# EAGLE design pcbmotor (EAGLE 9.3.2)
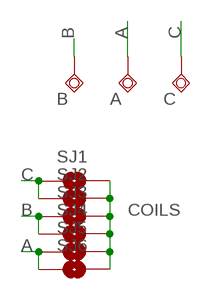
[diagram p0: schematic, sheet 1]

## Parts
A  TESTPAD_TPSQPAD1-20Y  [TESTPAD_P1-20Y]
B  TESTPAD_TPSQPAD1-20Y  [TESTPAD_P1-20Y]
C  TESTPAD_TPSQPAD1-20Y  [TESTPAD_P1-20Y]
SJ1  SOLDERJUMPERTRACE  [SJ_2S-TRACE]
SJ2  SOLDERJUMPERTRACE  [SJ_2S-TRACE]
SJ3  SOLDERJUMPERTRACE  [SJ_2S-TRACE]
SJ4  SOLDERJUMPERTRACE  [SJ_2S-TRACE]
SJ5  SOLDERJUMPERTRACE  [SJ_2S-TRACE]
SJ6  SOLDERJUMPERTRACE  [SJ_2S-TRACE]

## Nets
A: A.TP SJ5.1 SJ6.1
B: B.TP SJ3.1 SJ4.1
C: C.TP SJ1.1 SJ2.1
COILS: SJ1.2 SJ2.2 SJ3.2 SJ4.2 SJ5.2 SJ6.2

## Library data of the parts
A B C = BeagleBone_Blue_R3:TESTPAD_TPSQ: Test pad
SJ1-SJ6 = SparkFun:SOLDERJUMPER: Solder Jumper Standard SMD solder jumper. Used to automate production. Two varients : Normally Open and Normally Closed are the same, but have different paste layers. NC will have a large amount of paste and should jumper during reflow.

## Board
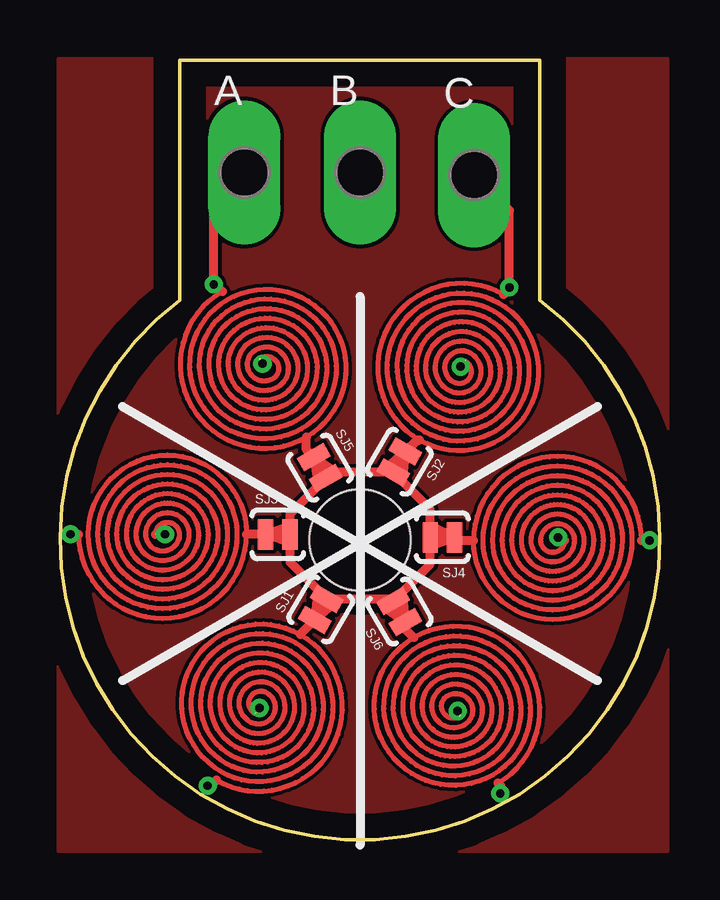
[diagram p1: board, top side]
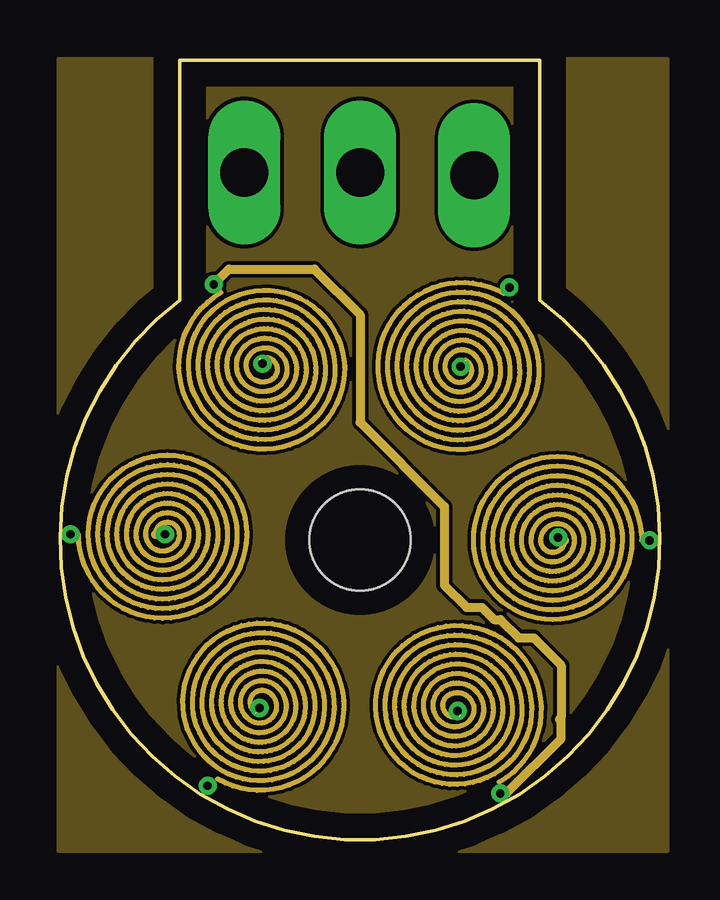
[diagram p2: board, inner layer Route2]
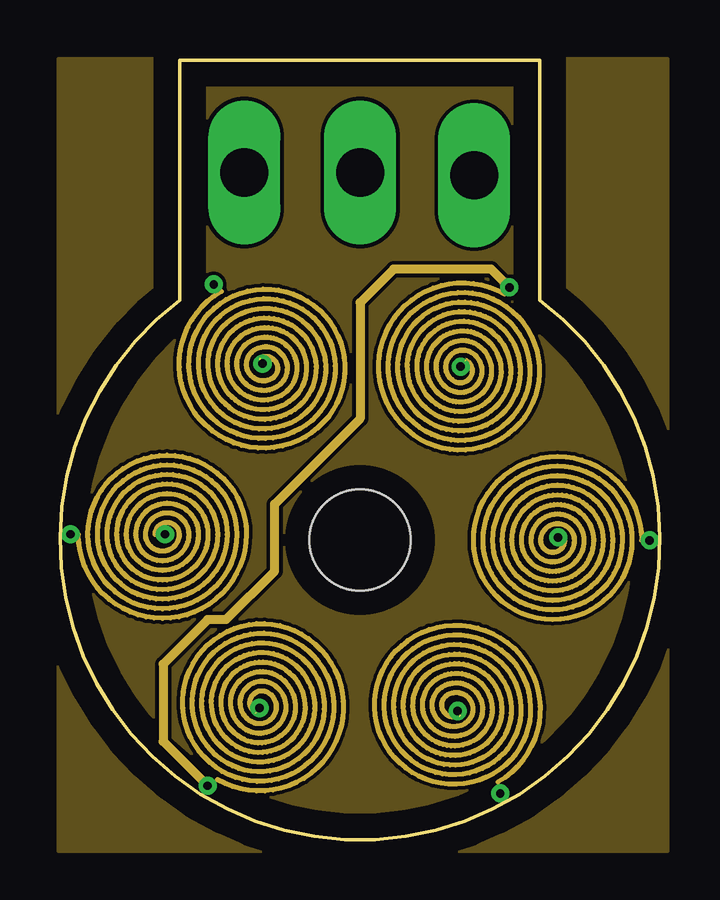
[diagram p3: board, inner layer Route15]
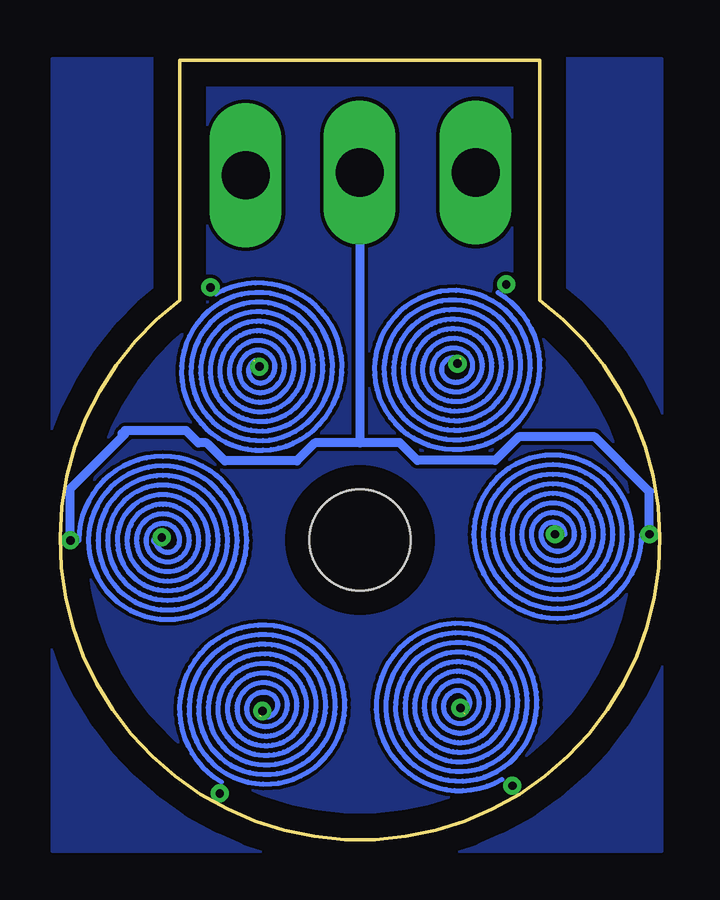
[diagram p4: board, bottom side, seen from below]

Size 25 x 32.48 mm. Coordinates in mm from the lower left corner, seen from the top.
Outline: 20,32.48 5,32.48 5,22.48 arc286 20,22.48 20,32.48
Copper layers (1+2*15+16): Top 0.035mm / dielectric 1.5mm / Route2 0.035mm / dielectric 0.15mm / Route15 0.035mm / dielectric 0.2mm / Bottom 0.035mm
Design rules "default *": minimum track width 6mil, minimum drill 0.35mm, track to track 6mil, track to pad 6mil, pad to pad 6mil, via to via 6mil, smd to smd 6mil, copper to edge 40mil, drill to drill 6mil, minimum pad ring 10mil, minimum via ring 8mil, stop-mask expansion 4mil, vias tented up to drill 0mil, thermal gap 10mil
Holes 4.2 mm at 12.5,12.48

### Footprints (pad centres in the part's own frame; a part is rotated, then mirrored left to right if it is on the bottom)
TESTPAD_P1-20Y = drill 2.007 pad 2.54 long: TP 0,0
SJ_2S-TRACE = smd 0.635 x 1.27: 1 -0.508,0; 2 0.508,0

### Placement (x,y rotation side)
A  7.68,27.79 0 top
B  12.51,27.79 0 top
C  17.26,27.68 0 top
SJ1  10.86,9.59 60 top
SJ2  14.14,15.74 240 top
SJ3  9.07,12.72 0 top
SJ4  15.93,12.59 180 top
SJ5  10.82,15.5 300 top
SJ6  14.14,9.5 120 top

### Tracks (layer width: path | path; a pad name or v marks a point on that pad's centre or on a via)
A  (via drill 0.35)  (6 unrouted)
  Top 0.2: 8.36,20.06 arc-180 8.86,19.2 arc-180 8.16,20.41 arc-180 9.06,18.85 arc-180 7.96,20.76 arc-180 9.26,18.5 arc-180 7.76,21.1 arc-180 9.46,18.16 arc-180 7.56,21.45 arc-180 9.66,17.81 arc-180 7.36,21.8 arc-180 9.86,17.47 arc-180 7.16,22.14 arc-180 10.06,17.12 arc-180 6.96,22.49 arc-180 10.26,16.77 arc-180 6.76,22.83 | 16.64,5.13 arc-180 16.14,5.99 arc-180 16.84,4.78 arc-180 15.94,6.34 arc-180 17.04,4.43 arc-180 15.74,6.68 arc-180 17.24,4.09 arc-180 15.54,7.03 arc-180 17.44,3.74 arc-180 15.34,7.38 arc-180 17.64,3.39 arc-180 15.14,7.72 arc-180 17.84,3.05 arc-180 14.94,8.07 arc-180 18.04,2.7 arc-180 14.74,8.42 arc-180 18.24,2.35
  Top 0.381: v18.34,1.93 18.34,2.25 18.24,2.35 | 6.76,22.83 6.46,23.14 v6.41,23.14 6.41,26.52 A.TP | SJ6.1 14.4,8.77 14.74,8.42 | SJ5.1 10.26,16.25 10.26,16.77 | SJ6.1 13.52,9.67 14.28,10.05 SJ6.1 | SJ5.1 11.36,15.39 10.72,15.01 SJ5.1
  Route2 0.2: 8.31,20.02 arc-180 8.81,19.16 arc-180 8.11,20.37 arc-180 9.01,18.81 arc-180 7.91,20.72 arc-180 9.21,18.47 arc-180 7.71,21.06 arc-180 9.41,18.12 arc-180 7.51,21.41 arc-180 9.61,17.77 arc-180 7.31,21.76 arc-180 9.81,17.43 arc-180 7.11,22.1 arc-180 10.01,17.08 arc-180 6.91,22.45 arc-180 10.21,16.73 arc-180 6.71,22.8 | 16.7,5.16 arc-180 16.2,6.03 arc-180 16.9,4.82 arc-180 16,6.38 arc-180 17.1,4.47 arc-180 15.8,6.72 arc-180 17.3,4.13 arc-180 15.6,7.07 arc-180 17.5,3.78 arc-180 15.4,7.42 arc-180 17.7,3.43 arc-180 15.2,7.76 arc-180 17.9,3.09 arc-180 15,8.11 arc-180 18.1,2.74 arc-180 14.8,8.46 arc-180 18.3,2.39
  Route2 0.381: v6.41,23.14 7.04,23.77 10.6,23.77 12.5,21.87 12.5,17.39 16.02,13.87 16.02,10.6 16.95,9.67 17.58,9.67 18.09,9.17 18.34,9.17 19.11,8.4 19.74,8.4 20.88,7.26 20.88,5.09 | 20.88,5.09 20.81,5 | v18.34,1.93 18.6,1.93 20.88,4.21 20.88,5.09
  Route15 0.2: 16.66,5.17 arc-180 16.16,6.04 arc-180 16.86,4.83 arc-180 15.96,6.38 arc-180 17.06,4.48 arc-180 15.76,6.73 arc-180 17.26,4.13 arc-180 15.56,7.08 arc-180 17.46,3.79 arc-180 15.36,7.42 arc-180 17.66,3.44 arc-180 15.16,7.77 arc-180 17.86,3.09 arc-180 14.96,8.12 arc-180 18.06,2.75 arc-180 14.76,8.46 arc-180 18.26,2.4 | 8.32,20.07 arc-180 8.82,19.2 arc-180 8.12,20.42 arc-180 9.02,18.86 arc-180 7.92,20.76 arc-180 9.22,18.51 arc-180 7.72,21.11 arc-180 9.42,18.17 arc-180 7.52,21.46 arc-180 9.62,17.82 arc-180 7.32,21.8 arc-180 9.82,17.47 arc-180 7.12,22.15 arc-180 10.02,17.13 arc-180 6.92,22.5 arc-180 10.22,16.78 arc-180 6.72,22.84
  Bottom 0.2: 8.35,20.01 arc-180 8.85,19.15 arc-180 8.15,20.36 arc-180 9.05,18.8 arc-180 7.95,20.71 arc-180 9.25,18.46 arc-180 7.75,21.05 arc-180 9.45,18.11 arc-180 7.55,21.4 arc-180 9.65,17.76 arc-180 7.35,21.75 arc-180 9.85,17.42 arc-180 7.15,22.09 arc-180 10.05,17.07 arc-180 6.95,22.44 arc-180 10.25,16.72 arc-180 6.75,22.79 | 16.67,5.18 arc-180 16.17,6.04 arc-180 16.87,4.83 arc-180 15.97,6.39 arc-180 17.07,4.49 arc-180 15.77,6.74 arc-180 17.27,4.14 arc-180 15.57,7.08 arc-180 17.47,3.79 arc-180 15.37,7.43 arc-180 17.67,3.45 arc-180 15.17,7.78 arc-180 17.87,3.1 arc-180 14.97,8.12 arc-180 18.07,2.75 arc-180 14.77,8.47 arc-180 18.27,2.41
B  (via drill 0.35)  (3 unrouted)
  Top 0.2: 21.03,12.47 arc-180 20.03,12.47 arc-180 21.43,12.47 arc-180 19.63,12.47 arc-180 21.83,12.47 arc-180 19.23,12.47 arc-180 22.23,12.47 arc-180 18.83,12.47 arc-180 22.63,12.47 arc-180 18.43,12.47 arc-180 23.03,12.47 arc-180 18.03,12.47 arc-180 23.43,12.47 arc-180 17.63,12.47 arc-180 23.83,12.47 arc-180 17.23,12.47 arc-180 24.23,12.47 | 3.97,12.72 arc-180 4.97,12.72 arc-180 3.57,12.72 arc-180 5.37,12.72 arc-180 3.17,12.72 arc-180 5.77,12.72 arc-180 2.77,12.72 arc-180 6.17,12.72 arc-180 2.37,12.72 arc-180 6.57,12.72 arc-180 1.97,12.72 arc-180 6.97,12.72 arc-180 1.57,12.72 arc-180 7.37,12.72 arc-180 1.17,12.72 arc-180 7.77,12.72 arc-180 0.77,12.72
  Top 0.381: 0.77,12.72 v0.44,12.72 0.56,12.85 | v24.57,12.47 24.23,12.47 | B.TP 12.35,27.64 | SJ4.1 16.57,12.47 17.23,12.47 | SJ3.1 7.77,12.72 | SJ4.1 15.42,12.21 15.42,13.1 SJ4.1 | SJ3.1 9.58,13.1 9.58,12.34 SJ3.1 | v4.37,12.72 3.97,12.72 | v20.76,12.59 21.03,12.47
  Route2 0.2: 3.97,12.72 arc-180 4.97,12.72 arc-180 3.57,12.72 arc-180 5.37,12.72 arc-180 3.17,12.72 arc-180 5.77,12.72 arc-180 2.77,12.72 arc-180 6.17,12.72 arc-180 2.37,12.72 arc-180 6.57,12.72 arc-180 1.97,12.72 arc-180 6.97,12.72 arc-180 1.57,12.72 arc-180 7.37,12.72 arc-180 1.17,12.72 arc-180 7.77,12.72 arc-180 0.77,12.72 | 21.03,12.47 arc-180 20.03,12.47 arc-180 21.43,12.47 arc-180 19.63,12.47 arc-180 21.83,12.47 arc-180 19.23,12.47 arc-180 22.23,12.47 arc-180 18.83,12.47 arc-180 22.63,12.47 arc-180 18.43,12.47 arc-180 23.03,12.47 arc-180 18.03,12.47 arc-180 23.43,12.47 arc-180 17.63,12.47 arc-180 23.83,12.47 arc-180 17.23,12.47 arc-180 24.23,12.47
  Route2 0.381: v20.76,12.59 21.03,12.47 | 3.97,12.72 v4.37,12.72
  Route15 0.2: 3.97,12.72 arc-180 4.97,12.72 arc-180 3.57,12.72 arc-180 5.37,12.72 arc-180 3.17,12.72 arc-180 5.77,12.72 arc-180 2.77,12.72 arc-180 6.17,12.72 arc-180 2.37,12.72 arc-180 6.57,12.72 arc-180 1.97,12.72 arc-180 6.97,12.72 arc-180 1.57,12.72 arc-180 7.37,12.72 arc-180 1.17,12.72 arc-180 7.77,12.72 arc-180 0.77,12.72 | 21.03,12.47 arc-180 20.03,12.47 arc-180 21.43,12.47 arc-180 19.63,12.47 arc-180 21.83,12.47 arc-180 19.23,12.47 arc-180 22.23,12.47 arc-180 18.83,12.47 arc-180 22.63,12.47 arc-180 18.43,12.47 arc-180 23.03,12.47 arc-180 18.03,12.47 arc-180 23.43,12.47 arc-180 17.63,12.47 arc-180 23.83,12.47 arc-180 17.23,12.47 arc-180 24.23,12.47
  Bottom 0.2: 3.96,12.72 arc-180 4.96,12.72 arc-180 3.56,12.72 arc-180 5.36,12.72 arc-180 3.16,12.72 arc-180 5.76,12.72 arc-180 2.76,12.72 arc-180 6.16,12.72 arc-180 2.36,12.72 arc-180 6.56,12.72 arc-180 1.96,12.72 arc-180 6.96,12.72 arc-180 1.56,12.72 arc-180 7.36,12.72 arc-180 1.16,12.72 arc-180 7.76,12.72 arc-180 0.76,12.72 | 21.01,12.47 arc-180 20.01,12.47 arc-180 21.41,12.47 arc-180 19.61,12.47 arc-180 21.81,12.47 arc-180 19.21,12.47 arc-180 22.21,12.47 arc-180 18.81,12.47 arc-180 22.61,12.47 arc-180 18.41,12.47 arc-180 23.01,12.47 arc-180 18.01,12.47 arc-180 23.41,12.47 arc-180 17.61,12.47 arc-180 23.81,12.47 arc-180 17.21,12.47 arc-180 24.21,12.47
  Bottom 0.381: B.TP 12.51,16.54 | 12.51,16.54 12.5,16.53 14.38,16.53 15.13,15.78 18.13,15.78 18.8,16.45 18.9,16.53 19.23,16.53 19.74,17.04 22.28,17.04 | 22.28,17.04 22.41,16.91 | v24.57,12.47 24.57,14.63 22.28,16.91 22.28,17.04 | v0.44,12.72 0.44,14.5 2.72,16.79 5.89,16.79 6.87,15.8 10.11,15.8 10.84,16.54 12.51,16.54 | v20.76,12.59 21.01,12.47
C  (via drill 0.35)  (6 unrouted)
  Top 0.2: 16.89,19.94 arc-180 16.39,19.07 arc-180 17.09,20.28 arc-180 16.19,18.72 arc-180 17.29,20.63 arc-180 15.99,18.38 arc-180 17.49,20.98 arc-180 15.79,18.03 arc-180 17.69,21.32 arc-180 15.59,17.68 arc-180 17.89,21.67 arc-180 15.39,17.34 arc-180 18.09,22.01 arc-180 15.19,16.99 arc-180 18.29,22.36 arc-180 14.99,16.65 arc-180 18.49,22.71 | 8.12,5.25 arc-180 8.62,6.12 arc-180 7.92,4.91 arc-180 8.82,6.47 arc-180 7.72,4.56 arc-180 9.02,6.81 arc-180 7.52,4.21 arc-180 9.22,7.16 arc-180 7.32,3.87 arc-180 9.42,7.5 arc-180 7.12,3.52 arc-180 9.62,7.85 arc-180 6.92,3.17 arc-180 9.82,8.2 arc-180 6.72,2.83 arc-180 10.02,8.54 arc-180 6.52,2.48
  Top 0.381: v6.15,2.24 6.28,2.24 6.52,2.48 | 18.49,22.71 18.73,22.94 v18.73,23.01 18.73,26.22 C.TP | SJ1.1 10.02,8.56 10.02,8.54 | SJ2.1 14.86,16.65 14.99,16.65 | SJ1.1 11.36,9.8 10.72,10.18 SJ1.1 | SJ2.1 14.28,15.13 13.65,15.52 SJ2.1
  Route2 0.2: 16.9,19.98 arc-180 16.4,19.11 arc-180 17.1,20.32 arc-180 16.2,18.77 arc-180 17.3,20.67 arc-180 16,18.42 arc-180 17.5,21.02 arc-180 15.8,18.07 arc-180 17.7,21.36 arc-180 15.6,17.73 arc-180 17.9,21.71 arc-180 15.4,17.38 arc-180 18.1,22.06 arc-180 15.2,17.03 arc-180 18.3,22.4 arc-180 15,16.69 arc-180 18.5,22.75 | 8.17,5.29 arc-180 8.67,6.16 arc-180 7.97,4.95 arc-180 8.87,6.5 arc-180 7.77,4.6 arc-180 9.07,6.85 arc-180 7.57,4.25 arc-180 9.27,7.2 arc-180 7.37,3.91 arc-180 9.47,7.54 arc-180 7.17,3.56 arc-180 9.67,7.89 arc-180 6.97,3.21 arc-180 9.87,8.24 arc-180 6.77,2.87 arc-180 10.07,8.58 arc-180 6.57,2.52
  Route15 0.2: 8.16,5.27 arc-180 8.66,6.13 arc-180 7.96,4.92 arc-180 8.86,6.48 arc-180 7.76,4.58 arc-180 9.06,6.83 arc-180 7.56,4.23 arc-180 9.26,7.17 arc-180 7.36,3.88 arc-180 9.46,7.52 arc-180 7.16,3.54 arc-180 9.66,7.87 arc-180 6.96,3.19 arc-180 9.86,8.21 arc-180 6.76,2.84 arc-180 10.06,8.56 arc-180 6.56,2.5 | 16.93,19.96 arc-180 16.43,19.09 arc-180 17.13,20.31 arc-180 16.23,18.75 arc-180 17.33,20.65 arc-180 16.03,18.4 arc-180 17.53,21 arc-180 15.83,18.05 arc-180 17.73,21.35 arc-180 15.63,17.71 arc-180 17.93,21.69 arc-180 15.43,17.36 arc-180 18.13,22.04 arc-180 15.23,17.02 arc-180 18.33,22.38 arc-180 15.03,16.67 arc-180 18.53,22.73
  Route15 0.381: v18.73,23.01 17.96,23.77 13.9,23.77 12.5,22.37 12.5,17.54 8.94,13.98 8.94,11.19 6.91,9.17 6.15,9.17 4.3,7.31 4.3,4.1 v6.15,2.24
  Bottom 0.2: 8.17,5.28 arc-180 8.67,6.14 arc-180 7.97,4.93 arc-180 8.87,6.49 arc-180 7.77,4.59 arc-180 9.07,6.84 arc-180 7.57,4.24 arc-180 9.27,7.18 arc-180 7.37,3.89 arc-180 9.47,7.53 arc-180 7.17,3.55 arc-180 9.67,7.88 arc-180 6.97,3.2 arc-180 9.87,8.22 arc-180 6.77,2.85 arc-180 10.07,8.57 arc-180 6.57,2.51 | 16.89,19.96 arc-180 16.39,19.09 arc-180 17.09,20.3 arc-180 16.19,18.74 arc-180 17.29,20.65 arc-180 15.99,18.4 arc-180 17.49,21 arc-180 15.79,18.05 arc-180 17.69,21.34 arc-180 15.59,17.7 arc-180 17.89,21.69 arc-180 15.39,17.36 arc-180 18.09,22.03 arc-180 15.19,17.01 arc-180 18.29,22.38 arc-180 14.99,16.67 arc-180 18.49,22.73
COILS
  Top 0.381: SJ3.2 9.58,11.57 SJ1.2 | SJ1.2 13.79,10.03 SJ6.2 | SJ6.2 15.42,11.48 SJ4.2 | SJ4.2 15.42,13.76 SJ2.2 | SJ2.2 11.32,15.3 SJ5.2 | SJ5.2 9.58,13.56 SJ3.2 | SJ3.2 8.44,12.72 | SJ4.2 16.44,12.59 | SJ6.2 14.41,9.04 | SJ1.2 10.6,9.17 | SJ2.2 14.41,16.15 | SJ5.2 10.6,15.9
GND
  pour Bottom: -0.07,-0.49 25.33,-0.49 25.33,32.53 -0.07,32.53
  pour Route15: -0.07,-0.49 25.33,-0.49 25.33,32.53 -0.07,32.53
  pour Route2: -0.07,-0.49 25.33,-0.49 25.33,32.53 -0.07,32.53
  pour Top: -0.07,-0.49 25.33,-0.49 25.33,32.53 -0.07,32.53
N$8  (via drill 0.35)
  other vias: 16.69,19.71
N$9  (via drill 0.35)
  other vias: 8.44,19.83
N$10  (via drill 0.35)
  other vias: 16.57,5.36
N$11  (via drill 0.35)
  other vias: 8.31,5.48